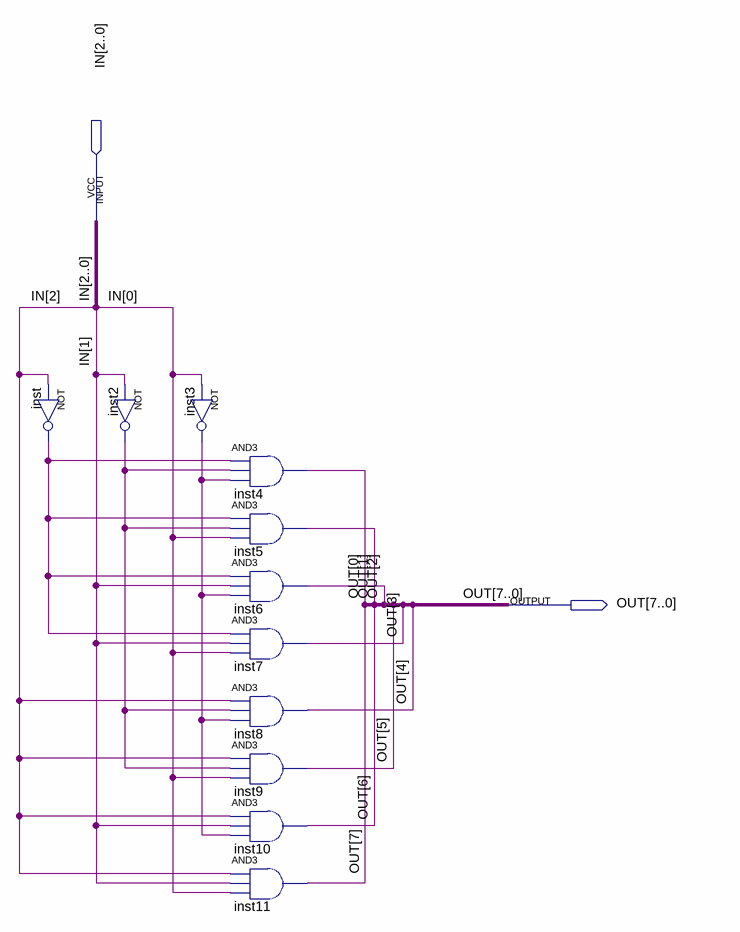
[diagram p0: schematic sheet]
// Quartus schematic 38encoder.bdf as structural Verilog: 11 symbols, 2 pins
module \38encoder  (
  input  [2:0] IN,
  output [7:0] OUT
);

  wire inst2_out, inst3_out, inst_out;

  not inst (inst_out, IN[2]);
  not inst2 (inst2_out, IN[1]);
  not inst3 (inst3_out, IN[0]);
  and inst4 (OUT[0], inst_out, inst2_out, inst3_out);
  and inst5 (OUT[1], inst_out, inst2_out, IN[0]);
  and inst6 (OUT[2], inst_out, IN[1], inst3_out);
  and inst7 (OUT[3], inst_out, IN[1], IN[0]);
  and inst8 (OUT[4], IN[2], inst2_out, inst3_out);
  and inst9 (OUT[5], IN[2], inst2_out, IN[0]);
  and inst10 (OUT[6], IN[2], IN[1], inst3_out);
  and inst11 (OUT[7], IN[2], IN[1], IN[0]);
endmodule
